# Altium schematic sheet P1.schdoc
size 355 x 220 mm; Symbol: Drawing-Symbol_A4; @Project Name: temp_sensor; @Page Count: 1; @Update Date: 2026-08-29; @Create Date: 2026-08-29; @Schematic Name: Schematic1; @Page No: 1; @Page Name: P1; Company: EasyEDA.com; Version: V2.0; Page Size: A4; Device: Drawing-Symbol_A4; @Create Time: 19:17:46; @Update Time: 19:17:46; Border: 1; Width: 1397.6377952755906; Height: 866.1417322834645; Region Start: 1; X Region Count: 6; Y Region Count: 4; Blade Width: 10; Title Block Position: 3; @Board Name: Board1
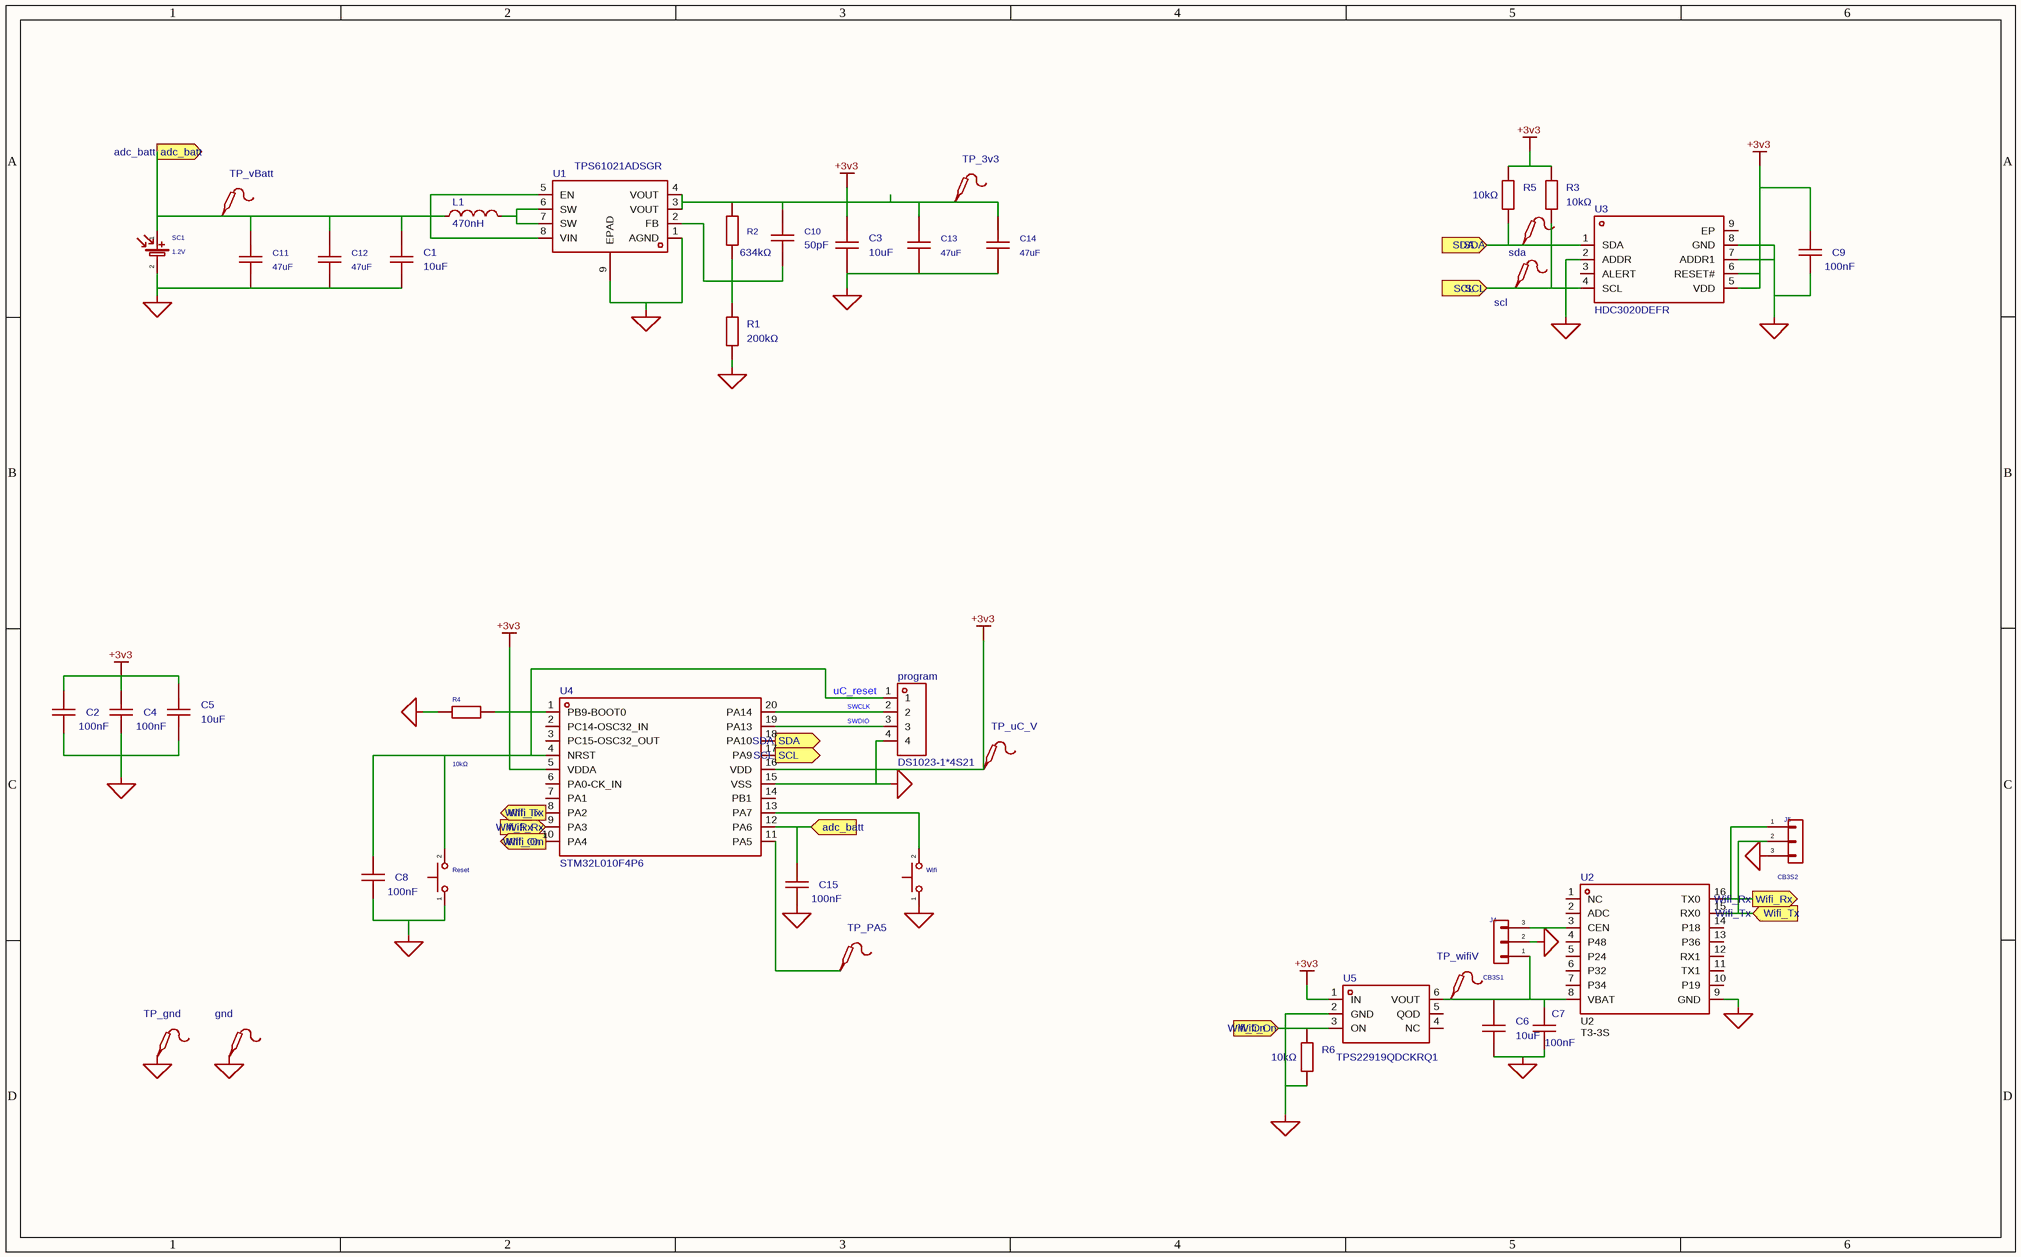
[diagram p0: P1.schdoc]

## Parts
C1  10uF  [C0402]
C2  100nF  [C0402]
C3  10uF  [C0402]
C4  100nF  [C0402]
C5  10uF  [C0402]
C6  10uF  [C0402]
C7  100nF  [C0402]
C8  100nF  [C0402]
C9  100nF  [C0402]
C10  50pF  [C0402]
C11  47uF  [C1206]
C12  47uF  [C1206]
C13  47uF  [C1206]
C14  47uF  [C1206]
C15  100nF  [C0402]
gnd  (no value)  [HDR-TH_1P-P2.54-V-F]
J4  value CB3S1  [Connector_PinHeader_2.54mm:PinHeader_1x03_P2.54mm_Vertical]  (hidden comment: Connector_Generic_Conn_01x03)
J5  value CB3S2  [Connector_PinHeader_2.54mm:PinHeader_1x03_P2.54mm_Vertical]  (hidden comment: Connector_Generic_Conn_01x03)
L1  470nH  [IND-SMD_L5.4-W5.2]
program  DS1023-1*4S21  [HDR-TH_DS1023-1X4S21]
R1  200kΩ  [R0402]
R2  634kΩ  [R0402]
R3  10kΩ  [R0603]
R4  10kΩ  [R0603]
R5  10kΩ  [R0603]
R6  10kΩ  [R0603]
Reset  Switch_SW_Push  [water_tank:SW_PUSH]  (value not drawn)
SC1  value 1.2V  [water_tank:JST_XH_B2B-XH-A_1x02_P2.50mm_Vertical]  (hidden comment: Device_Solar_Cell)
scl  (no value)  [HDR-TH_1P-P2.54-V-F]
sda  (no value)  [HDR-TH_1P-P2.54-V-F]
TP_3v3  (no value)  [HDR-TH_1P-P2.54-V-F]
TP_gnd  (no value)  [HDR-TH_1P-P2.54-V-F]
TP_PA5  (no value)  [HDR-TH_1P-P2.54-V-F]
TP_uC_V  (no value)  [HDR-TH_1P-P2.54-V-F]
TP_vBatt  (no value)  [HDR-TH_1P-P2.54-V-F]
TP_wifiV  (no value)  [HDR-TH_1P-P2.54-V-F]
U1  TPS61021ADSGR  [WSON-8_L2.0-W2.0-P0.50-TL-EP]
U2  (no value)  [T3-3S-footprint]
U3  HDC3020DEFR  [DFN-8_L2.5-W2.5-P0.50-BL-EP]
U4  STM32L010F4P6  [TSSOP-20_L6.5-W4.4-P0.65-LS6.4-BL]
U5  TPS22919QDCKRQ1  [SC-70-6_L2.0-W1.3-P0.65-LS2.1-BR]
Wifi  Switch_SW_Push  [water_tank:SW_PUSH]  (value not drawn)

## Ports
adc_batt (in), adc_batt (out), SCL (in), SCL (out), SDA (in), SDA (out), Wifi_On (in), Wifi_On (out), Wifi_Rx (in), Wifi_Rx (out), Wifi_Tx (in), Wifi_Tx (out)

## Nets
+3v3: C2.2 C3.2 C4.2 C5.2 C9.2 C10.2 C13.2 C14.2 R2.2 R3.2 R5.2 TP_3v3.1 TP_uC_V.1 U1.3(VOUT) U1.4(VOUT) U3.5(VDD) U3.6(RESET#) U4.5(VDDA) U4.16(VDD) U5.1(IN)
power_GNDREF: C1.1 C2.1 C3.1 C4.1 C5.1 C6.1 C7.1 C8.1 C9.1 C11.1 C12.1 C13.1 C14.1 C15.1 gnd.1 J4.2(Pin_2) J5.3(Pin_3) program.4 R1.1 R4.1 R6.1 Reset.1 SC1.2(-) TP_gnd.1 U1.1(AGND) U1.9(EPAD) U2.9(GND) U3.2(ADDR) U3.7(ADDR1) U3.8(GND) U4.15(VSS) U5.2(GND) Wifi.1
adc_batt: C1.2 C11.2 C12.2 C15.2 L1.1 SC1.1(+) TP_vBatt.1 U1.5(EN) U1.8(VIN) U4.12(PA6) ; port adc_batt
SCL: R3.1 scl.1 U3.4(SCL) U4.17(PA9) ; port SCL
SDA: R5.1 sda.1 U3.1(SDA) U4.18(PA10) ; port SDA
SWCLK: program.2 U4.20(PA14)
SWDIO: program.3 U4.19(PA13)
uC_reset: C8.2 program.1 Reset.2 U4.4(NRST)
Wifi_On: R6.2 U4.10(PA4) U5.3(ON) ; port Wifi_On
Wifi_Rx: J5.1(Pin_1) U2.16(TX0) U4.9(PA3) ; port Wifi_Rx
Wifi_Tx: J5.2(Pin_2) U2.15(RX0) U4.8(PA2) ; port Wifi_Tx
NetC6_2: C6.2 C7.2 J4.1(Pin_1) TP_wifiV.1 U2.8(VBAT) U5.6(VOUT)
NetC10_1: C10.1 R1.2 R2.1 U1.2(FB)
NetJ4_3: J4.3(Pin_3) U2.3(CEN)
NetL1_2: L1.2 U1.6(SW) U1.7(SW)
NetR4_2: R4.2 U4.1(PB9-BOOT0)
NetTP_PA5_1: TP_PA5.1 U4.11(PA5)
NetU4_13: U4.13(PA7) Wifi.2

Not connected (* = marked no-connect by the designer): U2 1(NC) 2(ADC) 4(P48) 5(P24) 6(P32) 7(P34) 10(P19) 11(TX1) 12(RX1) 13(P36) 14(P18); U3 3(ALERT) 9(EP); U4 2(PC14-OSC32_IN) 3(PC15-OSC32_OUT) 6(PA0-CK_IN) 7(PA1) 14(PB1); U5 4(NC) 5(QOD)

## Library data of the parts
C1 C3 C5 C6 = FCC0402X106M100AT: Capacitance:10uF Tolerance:±20% Tolerance:±20% Voltage Rating:10V Temperature Coefficient:X5R Operating Temperature:-55℃~+85℃ Operating Temperature:-55℃~+85℃; Manufacturer: FOJAN(富捷); Add into BOM: yes; 3D Model: b7d13df3e9464d7a99d0651d1a5b4d57; 3D Model Transform: 39.37,19.685,0,0,0,0,0,0,0; Tolerance: ±20%; Voltage Rating: 10V; Temperature Coefficient: X5R; ModelName: C0402_L1.0-W0.5-H0.5; Symbol: FCC0402X106M100AT; Device: FCC0402X106M100AT; Convert to PCB: yes; LCSC Part Name: 10uF ±20% 10V; Supplier Part: C7467116; Manufacturer Part: FCC0402X106M100AT; Supplier Footprint: 0402; JLCPCB Part Class: Extended Part; Datasheet: https://item.szlcsc.com/datasheet/FCC0402X106M100AT/8513653.html; Supplier: LCSC; Value: 10uF; Operating Temperature: -55℃~+85℃; FootprintName: C0402
C2 C4 C7-C9 C15 = FN15X104K160PNG: Capacitance:100nF Tolerance:±10% Tolerance:±10% Voltage Rating:16V Temperature Coefficient:X7R; Manufacturer: PSA(信昌电陶); Add into BOM: yes; 3D Model: b7d13df3e9464d7a99d0651d1a5b4d57; 3D Model Transform: 39.37,19.685,0,0,0,0,0,0,0; Tolerance: ±10%; Voltage Rating: 16V; Temperature Coefficient: X7R; ModelName: C0402_L1.0-W0.5-H0.5; Symbol: FN15X104K160PNG; Device: FN15X104K160PNG; Convert to PCB: yes; LCSC Part Name: 100nF ±10% 16V; Supplier Part: C328914; Manufacturer Part: FN15X104K160PNG; Supplier Footprint: 0402; JLCPCB Part Class: Extended Part; Datasheet: https://item.szlcsc.com/datasheet/FN15X104K160PNG/308763.html; Supplier: LCSC; Value: 100nF; FootprintName: C0402
C10 = CC0402JRNPO9BN500: Capacitance:50pF Tolerance:±5% Tolerance:±5% Voltage Rating:50V Temperature Coefficient:NP0; Manufacturer: YAGEO(国巨); Add into BOM: yes; 3D Model: b7d13df3e9464d7a99d0651d1a5b4d57; 3D Model Transform: 39.37,19.685,0,0,0,0,0,0,0; Tolerance: ±5%; Voltage Rating: 50V; Temperature Coefficient: NP0; ModelName: C0402_L1.0-W0.5-H0.5; Symbol: CC0402JRNPO9BN500; Device: CC0402JRNPO9BN500; Convert to PCB: yes; Supplier: LCSC; Supplier Part: C576707; Manufacturer Part: CC0402JRNPO9BN500; Value: 50pF; JLCPCB Part Class: Extended Part; LCSC Part Name: 50pF ±5% 50V; Supplier Footprint: 0402; Datasheet: https://item.szlcsc.com/datasheet/CC0402JRNPO9BN500/604198.html; FootprintName: C0402
C11-C14 = TCC1206X6S476M6R3HT: Capacitance:47uF Tolerance:±20% Tolerance:±20% Voltage Rating:6.3V Temperature Coefficient:X6S; Manufacturer: CCTC(三环); AddInBom: yes; ModelId: c6790e9475e1483991d2c64340b24e960819f05c4eef4c71ace90d822a990e87; ModelName: C1206_L3.2-W1.6-H1.3; ModelTransform: 125.984,62.992,0,0,0,0,0,0,0; Tolerance: ±20%; Voltage Rating: 6.3V; Temperature Coefficient: X6S; Symbol: TCC1206X6S476M6R3HT; Device: TCC1206X6S476M6R3HT; LCSC Part Name: 47uF ±20% 6.3V; SupplierPart: C53456069; ManufacturerPart: TCC1206X6S476M6R3HT; Supplier Footprint: 1206; JLCPCB Part Class: Extended Part; Datasheet: https://item.szlcsc.com/datasheet/TCC1206X6S476M6R3HT/56616434.html; Supplier: LCSC; ConvertToPcb: yes; FootprintName: C1206; Value: 47uF
gnd scl sda TP_3v3 TP_gnd TP_PA5 TP_uC_V TP_vBatt TP_wifiV = Test-Point: Test Point 测试点; AddInBom: yes; Symbol: Test-Point; Device: Test-Point; ConvertToPcb: yes; FootprintName: HDR-TH_1P-P2.54-V-F
J4 J5 = Connector_Generic_Conn_01x03: Generic connector, single row, 01x03, script generated (kicad-library-utils/schlib/autogen/connector/); Attribute1: J1; Add into BOM: no; ki_fp_filters: Connector*:*_1x??_*; Symbol: Connector_Generic_Conn_01x03; Device: Connector_Generic_Conn_01x03; UserDocLink: ~; Datasheet: ~; ki_keywords: connector; FootprintName: Connector_PinHeader_2.54mm:PinHeader_1x03_P2.54mm_Vertical
L1 = MWSA0518S-R47MT: Inductance:470nH Tolerance:±20% Tolerance:±20% Current Rating:10.5A Current - Saturation(Isat):12A DC Resistance(DCR):9mΩ Type:-; Manufacturer: Sunlord(顺络); Add into BOM: yes; 3D Model: 62c8372622354b599abb8c99af03c00b; 3D Model Transform: 212.598,204.728,0,0,0,0,0,0,0; Tolerance: ±20%; Current Rating: 10.5A; Current - Saturation(Isat): 12A; DC Resistance(DCR): 9mΩ; ModelName: IND-SMD_L5.4-W5.2-H3.0; Symbol: MWSA0518S-R47MT; Device: MWSA0518S-R47MT; Convert to PCB: yes; LCSC Part Name: 470nH ±20% 12A; Supplier Part: C408341; Manufacturer Part: MWSA0518S-R47MT; Supplier Footprint: SMD,5.4x5.2mm; JLCPCB Part Class: Extended Part; Datasheet: https://item.szlcsc.com/datasheet/MWSA0518S-R47MT/397743.html; Supplier: LCSC; Value: 470nH; Type: -; FootprintName: IND-SMD_L5.4-W5.2
program = DS1023-1*4S21: Manufacturer: CONNFLY; Add into BOM: no; ConvertToPcb: yes; Symbol: DS1023-1*4S21; Device: DS1023-1*4S21; LCSC Part Name: DS1023-1*4S21; SupplierPart: C7423131; ManufacturerPart: DS1023-1*4S21; Supplier Footprint: 1x4THT2.54mm; JLCPCB Part Class: Extended Part; Datasheet: https://item.szlcsc.com/datasheet/DS1023-1*4S21/8407821.html; Supplier: LCSC; FootprintName: HDR-TH_DS1023-1X4S21
R1 = AR02DTD2003: Type:Thin Film Resistor Resistance:200kΩ Tolerance:±0.5% Tolerance:±0.5% Power(Watts):62.5mW Voltage-Supply(Max):25V Temperature Coefficient:±50ppm/℃ Temperature Coefficient:±50ppm/℃ Operating Temperature:-55℃~+155℃ Operating Temperature:-55℃~+155℃; Manufacturer: Viking(光颉); AddInBom: yes; ModelId: efdecb7dae4442949d28eecaf748420f0819f05c4eef4c71ace90d822a990e87; ModelName: R0402_L1.0-W0.5-H0.4; ModelTransform: 39.37,19.685,0,0,0,0,0,0,0; Tolerance: ±0.5%; Power(Watts): 62.5mW; Voltage-Supply(Max): 25V; Symbol: AR02DTD2003; Device: AR02DTD2003; LCSC Part Name: 薄膜电阻 200kΩ ±0.5% 62.5mW; SupplierPart: C319775; ManufacturerPart: AR02DTD2003; Supplier Footprint: 0402; JLCPCB Part Class: Extended Part; Datasheet: https://item.szlcsc.com/datasheet/AR02DTD2003/300845.html; Supplier: LCSC; ConvertToPcb: yes; FootprintName: R0402; Type: Thin Film Resistor; Value: 200kΩ; Temperature Coefficient: ±50ppm/℃; Operating Temperature: -55℃~+155℃
R2 = 0402WGF6343TCE: Type:Thick Film Resistor Resistance:634kΩ Tolerance:±1% Tolerance:±1% Power(Watts):62.5mW Voltage-Supply(Max):50V Temperature Coefficient:±100ppm/℃ Temperature Coefficient:±100ppm/℃ Operating Temperature:-55℃~+155℃ Operating Temperature:-55℃~+155℃; Manufacturer: UNI-ROYAL(厚声); Add into BOM: yes; 3D Model: efdecb7dae4442949d28eecaf748420f; 3D Model Transform: 39.37,19.685,0,0,0,0,0,0,0; Tolerance: ±1%; Power(Watts): 62.5mW; Voltage-Supply(Max): 50V; ModelName: R0402_L1.0-W0.5-H0.4; Symbol: 0402WGF6343TCE; Device: 0402WGF6343TCE; Convert to PCB: yes; Supplier: LCSC; Supplier Part: C270588; Manufacturer Part: 0402WGF6343TCE; Value: 634kΩ; JLCPCB Part Class: Extended Part; LCSC Part Name: 634kΩ ±1% 62.5mW 厚膜电阻; Supplier Footprint: 0402; Datasheet: https://item.szlcsc.com/datasheet/0402WGF6343TCE/259968.html; Type: Thick Film Resistor; Temperature Coefficient: ±100ppm/℃; Operating Temperature: -55℃~+155℃; FootprintName: R0402
R3-R6 = RC0603FR-0710KL: Type:Thick Film Resistor Resistance:10kΩ Tolerance:±1% Tolerance:±1% Power(Watts):100mW Voltage-Supply(Max):75V Temperature Coefficient:±100ppm/℃ Temperature Coefficient:±100ppm/℃ Operating Temperature:-55℃~+155℃ Operating Temperature:-55℃~+155℃; Manufacturer: YAGEO(国巨); Add into BOM: yes; 3D Model: 112863783b5b41f1b5254f87eedc7932; 3D Model Transform: 31.8897,63.7794,0,90,0,0,0,0,0; Tolerance: ±1%; Power(Watts): 100mW; Voltage-Supply(Max): 75V; Symbol: RC0603FR-0710KL; Device: RC0603FR-0710KL; Convert to PCB: yes; LCSC Part Name: 厚膜电阻 10kΩ ±1% 100mW; Supplier Part: C98220; Manufacturer Part: RC0603FR-0710KL; Supplier Footprint: 0603; JLCPCB Part Class: Extended Part; Datasheet: https://item.szlcsc.com/datasheet/RC0603FR-0710KL/99429.html; Supplier: LCSC; Type: Thick Film Resistor; Value: 10kΩ; Temperature Coefficient: ±100ppm/℃; Operating Temperature: -55℃~+155℃; FootprintName: R0603; ModelName: R0603
Reset = Switch_SW_Push: Push button switch, generic, two pins; Value: Reset; ki_keywords: switch normally-open pushbutton push-button; AddInBom: yes; Symbol: Switch_SW_Push; Device: Switch_SW_Push; UserDocLink: ~; Datasheet: ~; FootprintName: water_tank:SW_PUSH
SC1 = Device_Solar_Cell: Single solar cell; AddInBom: yes; Symbol: Device_Solar_Cell; Device: Device_Solar_Cell; UserDocLink: ~; Datasheet: ~; ki_keywords: solar cell; FootprintName: water_tank:JST_XH_B2B-XH-A_1x02_P2.50mm_Vertical
U1 = TPS61021ADSGR: Function:Boost type Output Type:Adjustable Voltage - Supply:500mV~4.4V Voltage - Supply:500mV~4.4V Output Voltage:1.8V~4V Output Voltage:1.8V~4V Output Current:3A Frequency - Switching:2MHz Frequency - Switching:2MHz Operating Temperature:-40℃~+125℃@(TJ); Manufacturer: TI(德州仪器); Add into BOM: yes; 3D Model: 04262d34460447b78330cda95c62d324; 3D Model Transform: 79.527,78.74,0,0,0,0,0,0,0; Output Current: 3A; Frequency - Switching: 2MHz; Number of Outputs: 1; Topology: Boost; Switch tube (built-in/external): Built-in; ModelName: WSON-8_L2.0-W2.0-H0.8-P0.50; Symbol: TPS61021ADSGR; Device: TPS61021ADSGR; Convert to PCB: yes; LCSC Part Name: TPS61021ADSGR; Supplier Part: C193037; Manufacturer Part: TPS61021ADSGR; Supplier Footprint: WSON-8-EP(2x2); JLCPCB Part Class: Extended Part; Datasheet: https://www.ti.com/cn/lit/gpn/tps61021a; Supplier: LCSC; Function: Boost type; Voltage - Supply: 500mV~4.4V; Output Voltage: 1.8V~4V; Operating Temperature: -40℃~+125℃@(TJ); Synchronous Rectifier: Yes; Quiescent Current: -; Output Type: Adjustable; FootprintName: WSON-8_L2.0-W2.0-P0.50-TL-EP
U2 = T3-3S: Tuya module; Add into BOM: no; ConvertToPcb: yes; Symbol: T3-3S; Device: T3-3S; FootprintName: T3-3S-footprint
U3 = HDC3020DEFR: Temperature Range:-40℃~+125℃ Temperature Range:-40℃~+125℃ Humidity:0%RH~100%RH Humidity:0%RH~100%RH Interface:I2C Voltage - Supply:1.62V~5.5V Voltage - Supply:1.62V~5.5V Current - Supply:400nA Humidity Tolerance:±0.5%RH Humidity Tolerance:±0.5%RH Temperat; Manufacturer: TI(德州仪器); AddInBom: yes; ModelId: d4ef48fd7a324c65a1f32bce7974c00b0819f05c4eef4c71ace90d822a990e87; ModelName: DFN-8_L2.5-W2.5-H1.0-P0.50; ModelTransform: 99.2124,98.425,0,90,0,0,-0.003,-0.003,0; Interface: I2C; Current - Supply: 400nA; Humidity Tolerance: ±0.5%RH; Temperature Tolerance: ±0.1℃; Resolution: 16bit; Symbol: HDC3020DEFR; Device: HDC3020DEFR; LCSC Part Name: 数字式相对湿度传感器，具备长期漂移特性、响应功能、低功耗特性、失调误差校正功能，集成温度传感器; SupplierPart: C7472806; ManufacturerPart: HDC3020DEFR; Supplier Footprint: WSON-8(2.5x2.5); JLCPCB Part Class: Extended Part; Datasheet: https://item.szlcsc.com/datasheet/HDC3020DEFR/8533357.html; Supplier: LCSC; ConvertToPcb: yes; FootprintName: DFN-8_L2.5-W2.5-P0.50-BL-EP; Temperature Range: -40℃~+125℃; Humidity: 0%RH~100%RH; Voltage - Supply: 1.62V~5.5V; Features: Drift/aging compensation；Built-in heater；Low power drive measurement
U4 = STM32L010F4P6: CPU Core:ARM Cortex-M0+ CPU Maximum Speed:32MHz Core Size:32 Bit Program Storage Size:16KB Program Memory Type:FLASH RAM Size:2KB EEPROM:128Byte Number of I/O:16 ADC (Bit):12bit Oscillator Type:Built-in Voltage - Supply:1.8V~3.6V Voltage - Supply:1.8V~3.6; Manufacturer: ST(意法半导体); AddInBom: yes; ModelId: d00c537554e8428abe371c2c4fe2166f0819f05c4eef4c71ace90d822a990e87; ModelName: TSSOP-20_L6.5-W4.4-H1.0-LS6.4-P0.65; ModelTransform: 251.969,255.906,0,90,0,0,0.0005,0,0; CPU Maximum Speed: 32MHz; Core Size: 32 Bit; Program Storage Size: 16KB; Program Memory Type: FLASH; RAM Size: 2KB; Number of I/O: 16; ADC (Bit): 12bit; Symbol: STM32L010F4P6; Device: STM32L010F4P6; LCSC Part Name: 超低功耗超值系列Arm Cortex-M0+ MCU，具有16-KB Flash存储器和32 MHz CPU; SupplierPart: C529415; ManufacturerPart: STM32L010F4P6; Supplier Footprint: TSSOP-20; JLCPCB Part Class: Extended Part; Datasheet: https://item.szlcsc.com/datasheet/STM32L010F4P6/549643.html; Supplier: LCSC; ConvertToPcb: yes; FootprintName: TSSOP-20_L6.5-W4.4-P0.65-LS6.4-BL; CPU Core: ARM Cortex-M0+; EEPROM: 128Byte; Oscillator Type: Built-in; Voltage - Supply: 1.8V~3.6V; Operating Temperature: -40℃~+85℃
U5 = TPS22919QDCKRQ1: Type:Load Switch Number of Channels:1 Control Input Logic:Active High Maximum Continuous Current:1.5A Voltage - Supply:1.6V~5.5V Voltage - Supply:1.6V~5.5V RDS(on):89mΩ Operating Temperature	-:-40℃~+125℃ Operating Temperature	-:-40℃~+125℃ Features:Over Te; Manufacturer: TI(德州仪器); 3D Model: df84906d417c4d929ec2e4259b3eb7400819f05c4eef4c71ace90d822a990e87; 3D Model Transform: 82.677,78.74,0,0,0,0,0,0,0; Number of Channels: 1; Maximum Continuous Current: 1.5A; RDS(on): 89mΩ; AddInBom: yes; ModelName: SC-70-6_L2.0-W1.3-H1.0-P0.65; Symbol: TPS22919QDCKRQ1; Device: TPS22919QDCKRQ1; LCSC Part Name: 5.5V 1.5A 90mΩ 自保护负载开关; Supplier Part: C2871558; Manufacturer Part: TPS22919QDCKRQ1; Supplier Footprint: SC-70-6; JLCPCB Part Class: Extended Part; Datasheet: https://www.ti.com/cn/lit/gpn/tps22919-q1; Supplier: LCSC; Type: Load Switch; Control Input Logic: Active High; Voltage - Supply: 1.6V~5.5V; Operating Temperature	-: -40℃~+125℃; Features: Over Temperature Protection；Short-Circuit  Protection(SCP); ConvertToPcb: yes; FootprintName: SC-70-6_L2.0-W1.3-P0.65-LS2.1-BR
Wifi = Switch_SW_Push: Push button switch, generic, two pins; Value: Wifi; ki_keywords: switch normally-open pushbutton push-button; AddInBom: yes; Symbol: Switch_SW_Push; Device: Switch_SW_Push; UserDocLink: ~; Datasheet: ~; FootprintName: water_tank:SW_PUSH